# EAGLE design sterownik_poprawki_led_v4 (EAGLE 5.11)
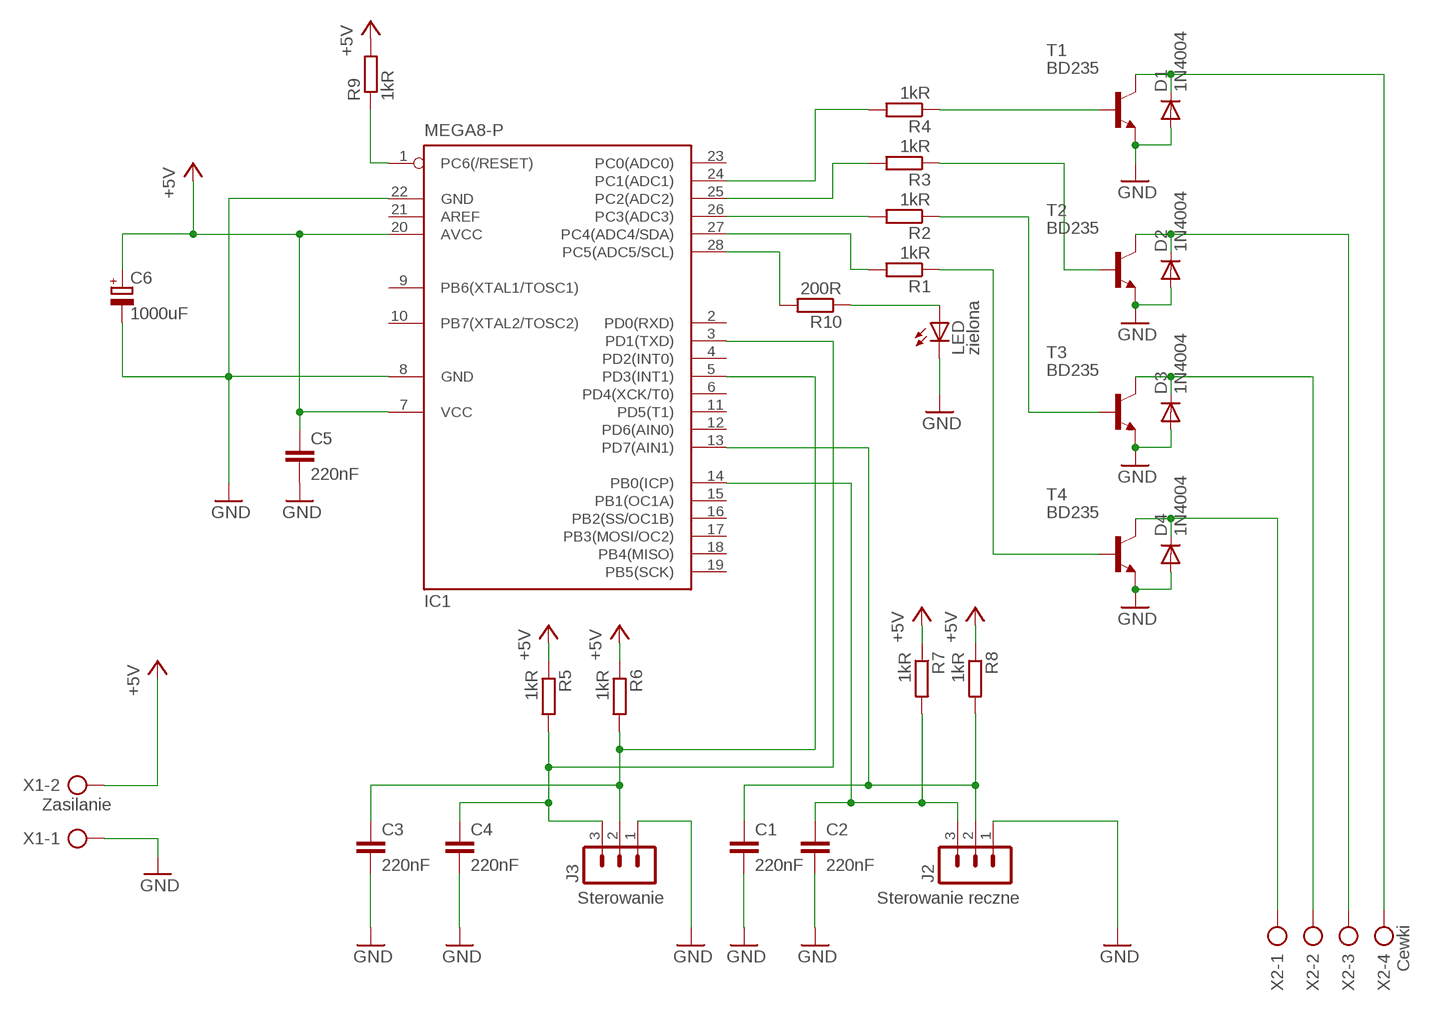
[diagram p0: schematic, sheet 1]

## Parts
C1  220nF  C-EU050-025X075  [C050-025X075]
C2  220nF  C-EU050-025X075  [C050-025X075]
C3  220nF  C-EU050-025X075  [C050-025X075]
C4  220nF  C-EU050-025X075  [C050-025X075]
C5  220nF  C-EU050-025X075  [C050-025X075]
C6  1000uF  CPOL-EUE5-8.5  [E5-8,5]
D1  1N4004  [DO41-10]
D2  1N4004  [DO41-10]
D3  1N4004  [DO41-10]
D4  1N4004  [DO41-10]
IC1  MEGA8-P  [DIL28-3]
J2  Sterowanie reczne  MA03-1  [MA03-1]
J3  Sterowanie  MA03-1  [MA03-1]
LED  zielona  LED5MM  [LED5MM]
R1  1kR  R-EU_0207/10  [0207/10]
R2  1kR  R-EU_0207/15  [0207/15]
R3  1kR  R-EU_0207/15  [0207/15]
R4  1kR  R-EU_0207/15  [0207/15]
R5  1kR  R-EU_0207/10  [0207/10]
R6  1kR  R-EU_0207/10  [0207/10]
R7  1kR  R-EU_0207/10  [0207/10]
R8  1kR  R-EU_0207/10  [0207/10]
R9  1kR  R-EU_0207/10  [0207/10]
R10  200R  R-EU_0207/10  [0207/10]
T1  BD235  [TO126]
T2  BD235  [TO126]
T3  BD235  [TO126]
T4  BD235  [TO126]
X1  Zasilanie  AK500/2  [AK500/2]
X2  Cewki  AK500/4  [AK500/4]

## Nets
+5V: C5.1 C6.+ IC1.7(VCC) IC1.20(AVCC) R5.1 R6.1 R7.1 R8.1 R9.2 X1.2
GND: C1.2 C2.2 C3.2 C4.2 C5.2 C6.- D1.A D2.A D3.A D4.A IC1.8(GND) IC1.22(GND) J2.1 J3.1 LED.K(C) T1.1(E) T2.1(E) T3.1(E) T4.1(E) X1.1
N$1: IC1.27(PC4(ADC4/SDA)) R1.2
N$2: IC1.28(PC5(ADC5/SCL)) R10.2
N$3: IC1.25(PC2(ADC2)) R3.2
N$4: IC1.24(PC1(ADC1)) R4.2
N$5: R4.1 T1.3(B)
N$6: R3.1 T2.3(B)
N$7: R2.1 T3.3(B)
N$8: R1.1 T4.3(B)
N$9: IC1.1(PC6(/RESET)) R9.1
N$11: C3.1 IC1.5(PD3(INT1)) J3.2 R6.2
N$12: D1.C T1.2(C) X2.4
N$13: IC1.26(PC3(ADC3)) R2.2
N$14: D2.C T2.2(C) X2.3
N$15: D3.C T3.2(C) X2.2
N$16: D4.C T4.2(C) X2.1
N$17: LED.A R10.1
N$23: C4.1 IC1.3(PD1(TXD)) J3.3 R5.2
N$25: C1.1 IC1.13(PD7(AIN1)) J2.2 R8.2
N$26: C2.1 IC1.14(PB0(ICP)) J2.3 R7.2
Unconnected: IC1.2(PD0(RXD)) IC1.4(PD2(INT0)) IC1.6(PD4(XCK/T0)) IC1.9(PB6(XTAL1/TOSC1)) IC1.10(PB7(XTAL2/TOSC2)) IC1.11(PD5(T1)) IC1.12(PD6(AIN0)) IC1.15(PB1(OC1A)) IC1.16(PB2(SS/OC1B)) IC1.17(PB3(MOSI/OC2)) IC1.18(PB4(MISO)) IC1.19(PB5(SCK)) IC1.21(AREF) IC1.23(PC0(ADC0))

## Library data of the parts
C1-C5 = rcl:C-EU: CAPACITOR, European symbol
C6 = resistor:CPOL-EU: POLARIZED CAPACITOR, European symbol
D1-D4 = diode:1N4004: DIODE general purpose rectifier, 1 A
IC1 = atmel:MEGA8-P: MICROCONTROLLER 8 Kbytes FLASH, 1 kbytes SRAM, 512 bytes EEPROM, USART, 4-channel 10 bit ADC, 2-channel 8 bit ADC Pin compatible with Atmega48, ATMega88, ATMega168 Source: avr.lbr; OC_FARNELL: unknown; OC_NEWARK: unknown
J2 J3 = con-lstb:MA03-1: PIN HEADER; OC_FARNELL: unknown; OC_NEWARK: unknown
LED = adafruit:LED: LED OSRAM: - CHIPLED LG R971, LG N971, LY N971, LG Q971, LY Q971, LO R971, LY R971 LH N974, LH R974 LS Q976, LO Q976, LY Q976 LO Q996 - Hyper CHIPLED LW Q18S LB Q993, LB Q99A, LB R99A - SideLED LS A670, LO A670, LY A670, LG A670, LP A670 LB A673, LV A673, LT A673, LW A673 LH A674 LY A675 LS A676, LA A676, LO A676, LY A676, LW A676 LS A679, LY A679, LG A679 - Hyper Micro SIDELED® LS Y876, LA Y876, LO Y876, LY Y876 LT Y87S - SmartLED LW L88C, LW L88S LB L89C, LB L89S, LG L890 LS L89K, LO L89K, LY L89K LS L896, LA L896, LO L896, LY L896 - TOPLED LS T670, LO T670, LY T670, LG T670, LP T670 LSG T670, LSP T670, LSY T670, LOP T670, LYG T670 LG T671, LOG T671, LSG T671 LB T673, LV T673, LT T673, LW T673 LH T674 LS T676, LA T676, LO T676, LY T676, LB T676, LH T676, LSB T676, LW T676 LB T67C, LV T67C, LT T67C, LS T67K, LO T67K, LY T67K, LW E67C LS E67B, LA E67B, LO E67B, LY E67B, LB E67C, LV E67C, LT E67C LW T67C LS T679, LY T679, LG T679 LS T770, LO T770, LY T770, LG T770, LP T770 LB T773, LV T773, LT T773, LW T773 LH T774 LS E675, LA E675, LY E675, LS T675 LS T776, LA T776, LO T776, LY T776, LB T776 LHGB T686 LT T68C, LB T68C - Hyper Mini TOPLED® LB M676 - Mini TOPLED Santana® LG M470 LS M47K, LO M47K, LY M47K Source: http://www.osram.convergy.de/
R1-R10 = rcl:R-EU_: RESISTOR, European symbol
T1-T4 = transistor-npn:BD235*: NPN Transistor
X1 = con-ptr500:AK500/2: CONNECTOR; OC_FARNELL: unknown; OC_NEWARK: unknown
X2 = con-ptr500:AK500/4: CONNECTOR; OC_FARNELL: unknown; OC_NEWARK: unknown

## Board
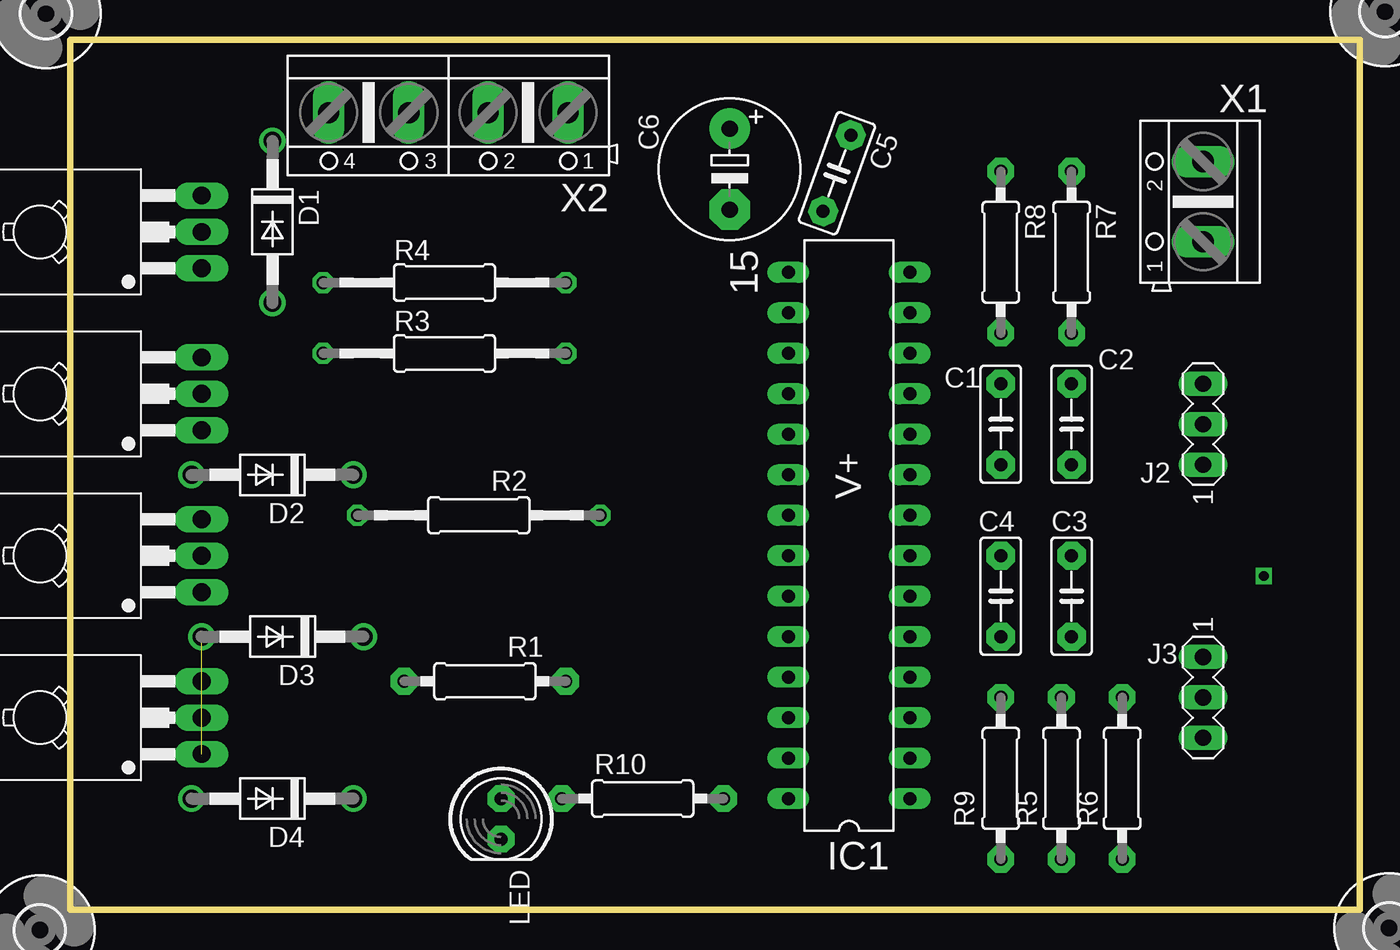
[diagram p1: board, top side]
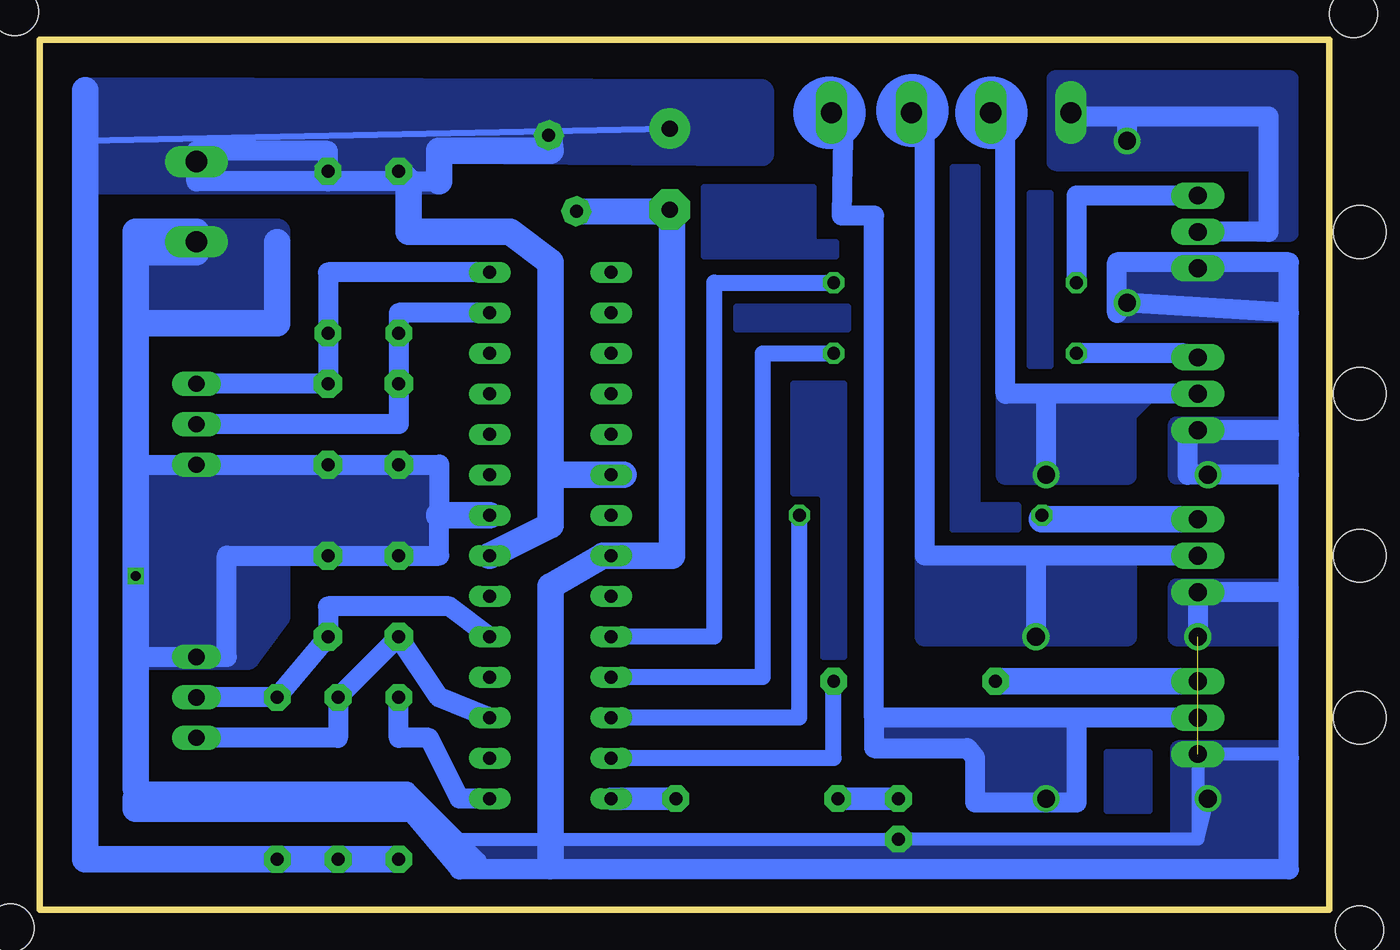
[diagram p2: board, bottom side, seen from below]

Size 80.95 x 54.6 mm. Coordinates in mm from the lower left corner, seen from the top.
Outline: 0,0 80.95,0 80.95,54.6 0,54.6 0,0
Copper layers (1*16): Top 0.035mm / dielectric 1.5mm / Bottom 0.035mm
Design rules "default *": minimum track width 10mil, minimum drill 24mil, track to track 8mil, track to pad 8mil, pad to pad 8mil, via to via 8mil, smd to smd 8mil, copper to edge 40mil, drill to drill 8mil, minimum pad ring 10mil, minimum via ring 8mil, stop-mask expansion 4mil, vias tented up to drill 0mil, thermal gap 10mil

### Footprints (pad centres in the part's own frame; a part is rotated, then mirrored left to right if it is on the bottom)
C050-025X075 = drill 0.813 pad 1.778 octagon: 1 -2.54,0; 2 2.54,0
E5-8,5 = drill 1.016 pad 2.54 round: + -2.54,0 | drill 1.016 pad 2.54 octagon: - 2.54,0
DO41-10 = drill 1.118 round: A 5.08,0; C -5.08,0
DIL28-3 = drill 0.813 long: 1 -16.51,-3.81; 2 -13.97,-3.81; 3 -11.43,-3.81; 4 -8.89,-3.81; 5 -6.35,-3.81; 6 -3.81,-3.81; 7 -1.27,-3.81; 8 1.27,-3.81; 9 3.81,-3.81; 10 6.35,-3.81; 11 8.89,-3.81; 12 11.43,-3.81; 13 13.97,-3.81; 14 16.51,-3.81; 15 16.51,3.81; 16 13.97,3.81; 17 11.43,3.81; 18 8.89,3.81; 19 6.35,3.81; 20 3.81,3.81; 21 1.27,3.81; 22 -1.27,3.81; 23 -3.81,3.81; 24 -6.35,3.81; 25 -8.89,3.81; 26 -11.43,3.81; 27 -13.97,3.81; 28 -16.51,3.81
MA03-1 = drill 1.016 long: 1 -2.54,0; 2 0,0; 3 2.54,0
LED5MM = drill 0.813 pad 1.676 octagon: A -1.27,0; K 1.27,0
0207/10 = drill 0.813 pad 1.676 octagon: 1 -5.08,0; 2 5.08,0
0207/15 = drill 0.813 octagon: 1 -7.62,0; 2 7.62,0
TO126 = drill 1.118 long: 1 -2.286,-5.08; 2 0,-5.08; 3 2.286,-5.08 | hole 3.302: 0,5.08
3,0 = hole 3: 0,0
AK500/2 = drill 1.321 long: 1 -2.515,0; 2 2.515,0
AK500/4 = drill 1.321 long: 1 -7.518,0; 2 -2.489,0; 3 2.489,0; 4 7.518,0

### Placement (x,y rotation side)
C1  58.42,30.48 270 top
C2  62.87,30.48 270 top
C3  62.87,19.69 90 top
C4  58.42,19.69 90 top
C5  48.13,46.23 250 top
C6  41.4,46.48 270 top
D1  12.7,43.18 270 top
D2  12.7,27.31 180 top
D3  13.34,17.15 180 top
D4  12.7,6.98 180 top
IC1  48.9,23.5 90 top
J2  71.12,30.48 90 top
J3  71.12,13.33 270 top
LED  27.05,5.71 270 top
R1  26.04,14.35 0 top
R2  25.65,24.77 0 top
R3  23.5,34.92 0 top
R4  23.5,39.37 0 top
R5  62.23,8.26 90 top
R6  66.04,8.26 90 top
R7  62.87,41.27 270 top
R8  58.42,41.27 270 top
R9  58.42,8.26 270 top
R10  35.94,6.98 0 top
T1  3.17,42.54 90 top
T2  3.17,32.38 90 top
T3  3.17,22.23 90 top
T4  3.17,12.06 90 top
U$1  [3,0]  -1.91,-1.27 0 top
U$2  [3,0]  82.8,-1.14 0 top
U$3  [3,0]  82.55,56.39 0 top
U$4  [3,0]  -1.52,56.26 0 top
X1  71.12,44.45 90 top
X2  23.75,50.04 180 top

### Tracks (layer width: path | path; a pad name or v marks a point on that pad's centre or on a via)
+5V
  Bottom 0.406: C6.+ 78.11,48.26 78.11,3.56
  Bottom 1.27: 55.88,45.72 57.78,45.72 62.87,45.72 | 62.87,45.72 71.12,45.72 71.12,47.62 62.87,47.62 R7.1 62.87,45.72
  Bottom 1.676: R9.2 R5.1 R6.1 78.11,3.17 78.11,3.56 78.11,51.43 | R8.1 57.78,45.72 57.78,42.54 51.44,42.54 48.9,40.64 48.9,27.31 | IC1.7 48.9,24.13 48.9,27.31 | 55.88,45.72 55.88,47.62 48.9,47.62 C5.1 | IC1.20 48.9,27.31
  pour Bottom (no thermals): 35.69,51.31 78.11,51.43 78.11,45.72 55.88,45.72 55.88,47.62 35.69,47.5
GND  (via drill 0.6)  (1 unrouted)
  Bottom 0.406: C6.- 41.27,43.94 41.27,43.43
  Bottom 0.813: 8.26,4.45 D4.A 8.26,6.98 | 8.26,4.45 T4.1 2.79,9.78 2.54,9.53 | T3.1 8.26,19.69 | 2.54,29.85 2.79,30.1 | T1.1 8.89,40 8.26,40.64 | 54.61,4.45 LED.K 8.26,4.45 | 54.61,4.45 53.98,3.17 53.34,3.17 | 54.61,2.54 53.34,3.17 | 74.93,7.62 57.78,7.62 54.61,4.45 | 53.34,3.17 54.61,4.45 | 74.93,6.98 57.78,6.98
  Bottom 1.016: 53.98,3.17 57.78,6.98
  Bottom 1.27: 2.79,19.94 T3.1 | 2.54,27.31 D2.A 8.89,27.31 8.89,29.85 T2.1 2.79,30.1 | 2.54,37.46 2.54,29.85 2.54,27.31 | 57.78,6.35 54.61,2.54 48.9,2.54 | 2.54,27.31 2.54,9.53 2.54,2.54 48.9,2.54 | 2.54,37.46 2.54,40.64 8.26,40.64 13.34,40.64 13.34,37.46 D1.A 2.54,37.46 | 74.93,6.98 74.93,7.62 | 48.9,2.54 48.9,3.17 | 74.93,15.88 J3.1 69.22,15.88 69.22,22.23 C3.2 C4.2 55.88,22.23 55.88,24.77 55.88,27.94 C1.2 C2.2 J2.1 74.93,27.94 | 8.26,19.69 D3.A
  Bottom 1.676: 57.78,6.35 74.93,6.35 74.93,6.98 | 74.93,36.83 74.93,27.94 v74.93,20.96 74.93,15.88 74.93,7.62 | 74.93,36.83 74.93,41.27 | 74.93,41.27 74.93,42.54 71.12,42.54 71.12,41.27 74.93,41.27 | 74.93,36.83 66.04,36.83 66.04,41.91 | 55.88,24.77 IC1.8 | 48.9,3.17 48.9,20.32 45.59,22.23 IC1.22 41.27,22.23 41.27,43.43 41.27,43.81 C5.2
  pour Bottom (no thermals): 66.04,42.54 74.3,42.54 74.3,37.46 66.04,37.46
  pour Bottom (no thermals): 57.15,27.31 74.93,27.31 74.93,15.88 67.94,15.88 66.04,18.42 66.04,22.86 57.15,22.86
  pour Bottom (no thermals): 2.54,10.03 9.4,10.03 9.4,3.81 54.61,3.81 54.61,2.54 2.54,2.54
  pour Bottom (no thermals): 2.54,40.64 13.34,40.64 13.34,37.46 2.54,37.46
  pour Bottom (no thermals): 2.54,20.19 2.54,17.15 9.53,17.15 9.53,20.19
  pour Bottom (no thermals): 2.54,30.35 2.54,27.31 9.53,27.31 9.53,30.35
N$1
  Bottom 1.016: R1.2 31.11,9.53 IC1.27
N$2
  Bottom 1.422: R10.2 IC1.28
N$3
  Bottom 1.016: R3.2 35.56,34.92 35.56,14.61 IC1.25
N$4
  Bottom 1.016: R4.2 38.61,39.37 38.61,17.15 IC1.24
N$5
  Bottom 1.27: T1.3 15.88,44.83 R4.1
N$6
  Bottom 1.27: R3.1 9.14,34.92 T2.3
N$7
  Bottom 1.27: 18.03,24.51 R2.1
  Bottom 1.676: T3.3 18.03,24.51
N$8
  Bottom 1.676: T4.3 R1.1
N$9
  Bottom 1.27: R9.1 58.42,10.79 56.52,10.79 54.61,6.98 IC1.1
N$10
  Bottom 1.676: 45.09,27.31 44.32,27.31
N$11
  Bottom 1.27: J3.2 R6.2 C3.1 62.87,19.05 55.24,19.05 IC1.5
N$12
  Bottom 1.27: T1.2 3.81,42.54 3.81,49.78 12.7,49.78 | 12.7,49.78 D1.C | 12.7,49.78 15.54,49.78
  pour Bottom (no thermals): 2.54,52.07 17.14,52.07 17.14,46.99 4.45,46.99 4.45,42.54 2.54,42.54
N$13
  Bottom 1.016: R2.2 33.27,24.64 33.27,12.06 IC1.26
N$14
  Bottom 0.406: 20.32,49.91 21.03,49.91 21.03,50.04 X2.3
  Bottom 1.27: 20.32,49.91 20.32,32.38 17.78,32.38 | 17.78,32.38 D2.C | T2.2 17.78,32.38
  pour Bottom (no thermals): 11.43,32.38 20.32,32.38 20.32,27.31 12.7,27.31 12.7,31.12
N$15
  Bottom 0.406: 25.4,49.91 26.04,49.91 26.04,50.04 X2.2
  Bottom 1.27: 25.4,49.91 25.4,22.23 18.29,22.23 | D3.C 18.41,21.97 18.29,22.23 | T3.2 18.29,22.23
  pour Bottom (no thermals): 12.7,22.23 12.7,17.15 25.4,17.15 25.4,22.23
N$16
  Bottom 0.406: 30.99,49.91 31.27,49.91 X2.1
  Bottom 1.27: 17.91,6.73 22.23,6.73 22.23,9.53 22.73,10.16 28.57,10.16 28.57,12.06 | 17.91,6.73 15.88,6.73 15.88,12.06 | 17.91,6.73 D4.C | T4.2 15.88,12.06 | 15.88,12.06 28.57,12.06 | 28.57,12.06 28.57,43.56 30.61,43.56 30.48,50.16 30.99,50.16 30.99,49.91 30.58,49.91
  pour Bottom (no thermals): 16.51,11.43 28.57,11.43 28.57,10.16 22.23,10.16 22.23,6.98 16.51,6.98
N$17
  Bottom 1.422: LED.A R10.1
N$18
  pour Bottom: 22.1,46.61 23.62,46.61 23.62,23.88 19.56,23.88 19.56,25.4 22.1,25.4
N$19
  pour Bottom: 33.66,33.02 33.66,26.16 32,26.16 31.75,25.91 31.75,15.88 30.48,15.88 30.48,33.02
N$20
  pour Bottom: 30.23,37.85 37.21,37.85 37.21,36.45 30.23,36.45
N$21
  pour Bottom: 30.99,41.91 32.38,41.91 32.38,45.34 39.24,45.34 39.24,41.02 30.99,41.02
N$23
  Bottom 1.27: J3.3 62.23,10.79 R5.2 C4.1 55.88,13.33 IC1.3
N$24
  pour Bottom: 11.3,9.91 13.97,9.91 13.97,6.22 11.3,6.22
N$25
  Bottom 1.27: J2.2 58.42,30.48 C1.1 R8.2 58.42,37.46 IC1.13
N$26
  Bottom 1.27: IC1.14 62.87,40 R7.2 C2.1 J2.3
N$28
  pour Bottom: 17.53,44.96 18.8,44.96 18.8,34.16 17.53,34.16 17.53,44.83
(copper drawn outside any net)
  shapes: Bottom circle x3

### Text on the board
tNames: 15 | V+